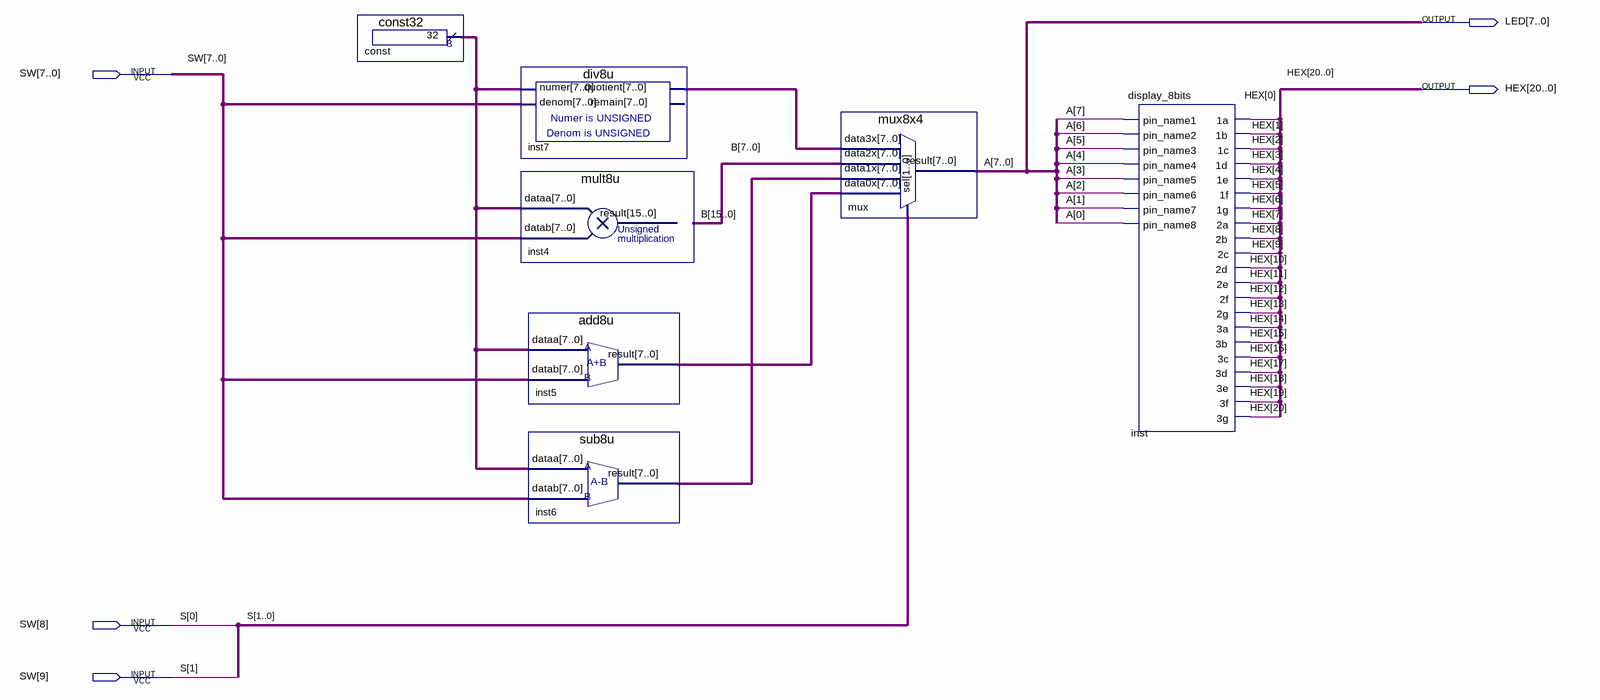
[diagram p0: schematic sheet]
// Quartus schematic alu_design.bdf as structural Verilog: 7 symbols, 5 pins
module alu_design (
  input  [9:0] SW,
  output [7:0] LED,
  output [20:0] HEX
);

  wire [7:0] const_result, inst5_result, inst6_result, inst7_quotient;
  wire [15:0] B;

  const32 \const  (.result(const_result));
  div8u inst7 (.numer(const_result), .denom(SW[7:0]), .quotient(inst7_quotient));  // open: remain
  mult8u inst4 (.dataa(const_result), .datab(SW[7:0]), .result(B));
  add8u inst5 (.dataa(const_result), .datab(SW[7:0]), .result(inst5_result));
  sub8u inst6 (.dataa(const_result), .datab(SW[7:0]), .result(inst6_result));
  mux8x4 mux (
    .data3x(inst7_quotient), .data2x(B[7:0]), .data1x(inst6_result), .data0x(inst5_result), .sel(SW[9:8]),
    .result(LED));
  display_8bits inst (
    .pin_name1(LED[7]), .pin_name2(LED[6]), .pin_name3(LED[5]), .pin_name4(LED[4]), .pin_name5(LED[3]),
    .pin_name6(LED[2]), .pin_name7(LED[1]), .pin_name8(LED[0]), .\1a (HEX[0]), .\1b (HEX[1]), .\1c (HEX[2]),
    .\1d (HEX[3]), .\1e (HEX[4]), .\1f (HEX[5]), .\1g (HEX[6]), .\2a (HEX[7]), .\2b (HEX[8]), .\2c (HEX[9]),
    .\2d (HEX[10]), .\2e (HEX[11]), .\2f (HEX[12]), .\2g (HEX[13]), .\3a (HEX[14]), .\3b (HEX[15]),
    .\3c (HEX[16]), .\3d (HEX[17]), .\3e (HEX[18]), .\3f (HEX[19]), .\3g (HEX[20]));

  // Other names for the same wires on the sheet: A[7:0] = LED; S[1:0] = SW[9:8]
endmodule
